# Altium schematic sheet 主控电路.SchDoc
size A4
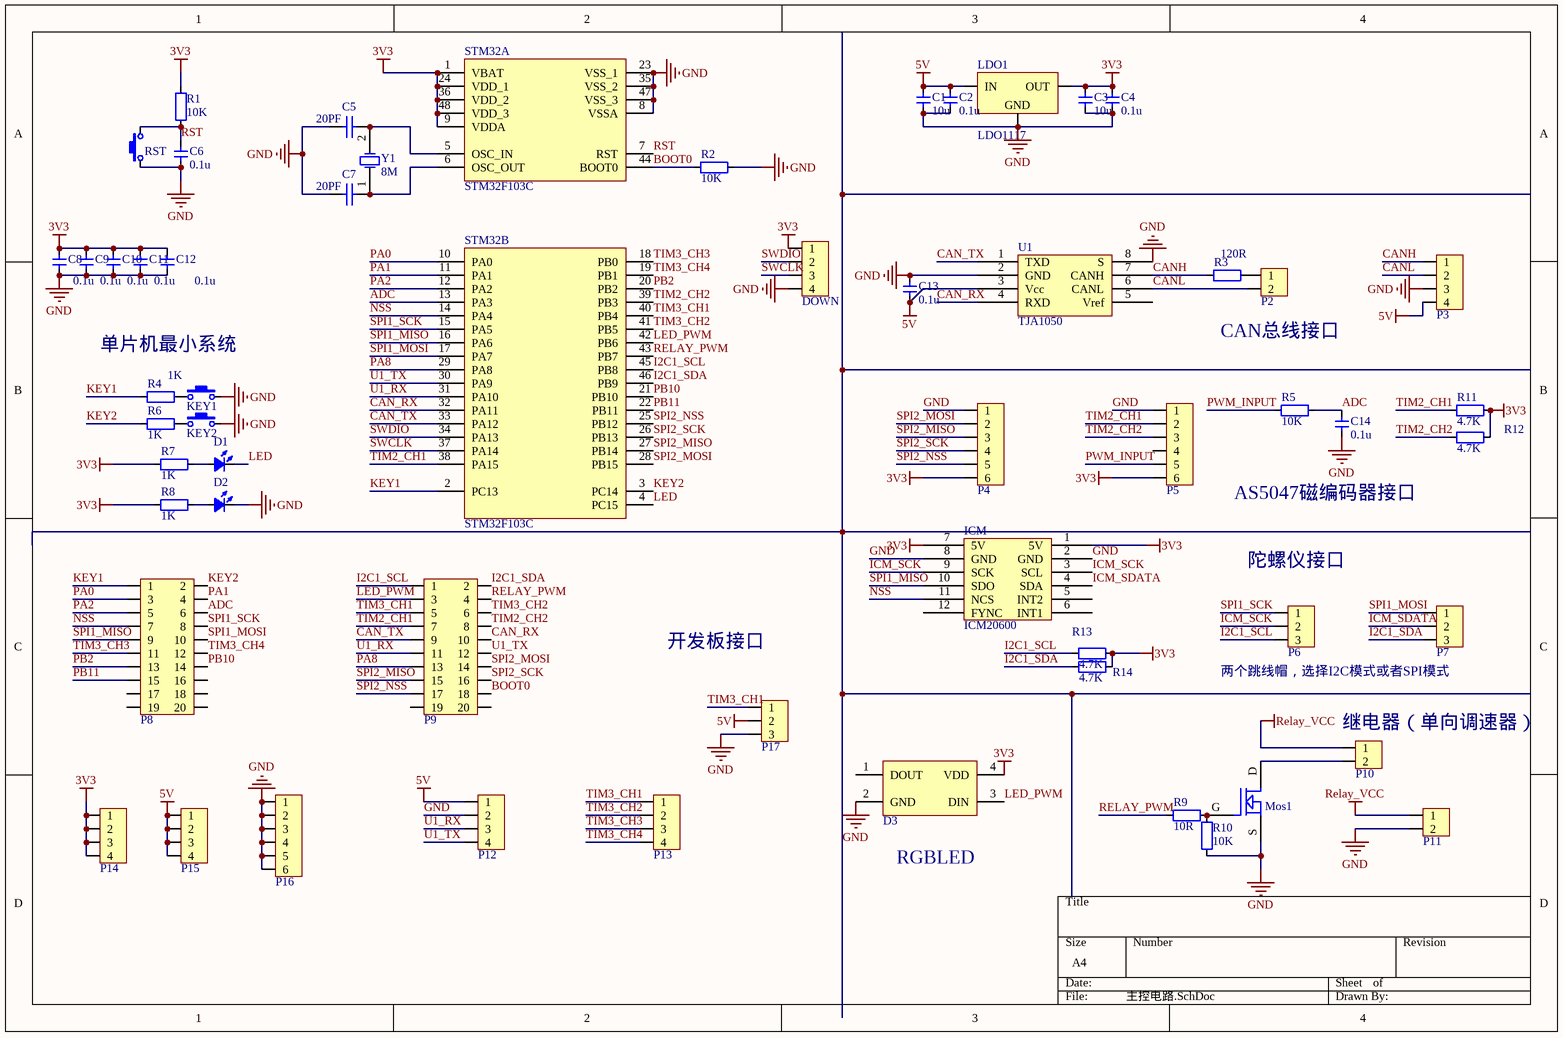
[diagram p0: 主控电路.SchDoc]

## Parts
C1  value 10u  [CAP_0805]  (hidden comment: CAP_0805)
C2  value 0.1u  [CAP_0805]  (hidden comment: CAP_0805)
C3  value 10u  [CAP_0805]  (hidden comment: CAP_0805)
C4  value 0.1u  [CAP_0805]  (hidden comment: CAP_0805)
C5  value 20PF  [CAP_0805]  (hidden comment: Cap)
C6  value 0.1u  [CAP_0805]  (hidden comment: CAP_0805)
C7  value 20PF  [CAP_0805]  (hidden comment: Cap)
C8  value 0.1u  [CAP_0805]  (hidden comment: CAP_0805)
C9  value 0.1u  [CAP_0805]  (hidden comment: CAP_0805)
C10  value 0.1u  [CAP_0805]  (hidden comment: CAP_0805)
C11  value 0.1u  [CAP_0805]  (hidden comment: CAP_0805)
C12  value 0.1u  [CAP_0805]  (hidden comment: CAP_0805)
C13  value 0.1u  [CAP_0805]  (hidden comment: CAP_0805)
C14  value 0.1u  [CAP_0805]  (hidden comment: CAP_0805)
D1  LED_0805  [LED_0805_RED]  (value not drawn)
D2  LED_0805  [LED_0805_RED]  (value not drawn)
D3  LED_3535_SK6812  [LED_3535_4P]  (value not drawn)
DOWN  HDR1x4_2.54  [HDR1x4_2.54_180]  (value not drawn)
ICM  ICM20600  [ICM20600模块]
KEY1  ButtonTACT_3x6x2.5_180  [ButtonTACT_3x6x2.5_180]  (value not drawn)
KEY2  ButtonTACT_3x6x2.5_180  [ButtonTACT_3x6x2.5_180]  (value not drawn)
LDO1  LDO1117  [SOT223-3]
Mos1  MOSFET N  [Nmos_SOT23]  (value not drawn)
P2  HDR1x2_2.54  [HDR1X2_2.54_180]  (value not drawn)
P3  HDR1x4_2.54  [HDR1x4_2.54_180]  (value not drawn)
P4  HDR1x6_2.54  [1.25mm_1X6_SMT]  (value not drawn)
P5  HDR1x6_2.54  [1.25mm_1X6_SMT]  (value not drawn)
P6  HDR1x3_2.54  [HDR1X3_2.54_180]  (value not drawn)
P7  HDR1x3_2.54  [HDR1X3_2.54_180]  (value not drawn)
P8  HDR2x10_2.54  [HDR2X10_2.54_180]  (value not drawn)
P9  HDR2x10_2.54  [HDR2X10_2.54_180]  (value not drawn)
P10  HDR1x2_2.54  [HDR1X2_2.54_180]  (value not drawn)
P11  HDR1x2_2.54  [HDR1X2_2.54_180]  (value not drawn)
P12  HDR1x4_2.54  [HDR1x4_2.54_180]  (value not drawn)
P13  HDR1x4_2.54  [HDR1x4_2.54_180]  (value not drawn)
P14  HDR1x4_2.54  [HDR1x4_2.54_180]  (value not drawn)
P15  HDR1x4_2.54  [HDR1x4_2.54_180]  (value not drawn)
P16  HDR1x6_2.54  [HDR1X6_2.54_180]  (value not drawn)
P17  HDR1x3_2.54  [HDR1X3_2.54_180]  (value not drawn)
R1  value 10K  [RES_0805]  (hidden comment: RES_0805)
R2  value 10K  [RES_0805]  (hidden comment: RES_0805)
R3  value 120R  [RES_0805]  (hidden comment: RES_0805)
R4  value 1K  [RES_0805]  (hidden comment: RES_0805)
R5  value 10K  [RES_0805]  (hidden comment: RES_0805)
R6  value 1K  [RES_0805]  (hidden comment: RES_0805)
R7  value 1K  [RES_0805]  (hidden comment: RES_0805)
R8  value 1K  [RES_0805]  (hidden comment: RES_0805)
R9  value 10R  [RES_0805]  (hidden comment: RES_0805)
R10  value 10K  [RES_0805]  (hidden comment: RES_0805)
R11  value 4.7K  [RES_0805]  (hidden comment: RES_0805)
R12  value 4.7K  [RES_0805]  (hidden comment: RES_0805)
R13  value 4.7K  [RES_0805]  (hidden comment: RES_0805)
R14  value 4.7K  [RES_0805]  (hidden comment: RES_0805)
RST  ButtonTACT_3x6x2.5_180  [ButtonTACT_3x6x2.5_180]  (value not drawn)
STM32  STM32F103C  [LQFP_P0.5_48]  (parts A,B of 2)
U1  TJA1050  [SOP_E150_8]
Y1  8M  [Osc-6032]

## Nets
3V3: C3.2 C4.2 C8.2 C9.2 C10.2 C11.2 C12.2 D3.4(VDD) DOWN.1 ICM.1(5V) ICM.7(5V) LDO1.2(OUT) P4.6 P5.6 P14.1 P14.2 P14.3 P14.4 R1.2 R7.1 R8.1 R11.1 R12.1 R13.1 R14.1 STM32.1(VBAT) STM32.9(VDDA) STM32.24(VDD_1) STM32.36(VDD_2) STM32.48(VDD_3)
5V: C1.2 C2.2 C13.1 LDO1.3(IN) P3.4 P12.1 P15.1 P15.2 P15.3 P15.4 P17.2 U1.3(Vcc)
GND: C1.1 C2.1 C3.1 C4.1 C5.1 C6.1 C7.1 C8.1 C9.1 C10.1 C11.1 C12.1 C13.2 C14.1 D2.2(K) D3.2(GND) DOWN.4 ICM.2(GND) ICM.8(GND) KEY1.2 KEY2.2 LDO1.1(GND) Mos1.S P3.3 P4.1 P5.1 P11.2 P12.2 P16.1 P16.2 P16.3 P16.4 P16.5 P16.6 P17.3 R2.2 R10.2 RST.1 STM32.8(VSSA) STM32.23(VSS_1) STM32.35(VSS_2) STM32.47(VSS_3) U1.2(GND) U1.8(S)
Relay_VCC: P10.1 P11.1
ADC: C14.2 P8.6 R5.1 STM32.13(PA3)
BOOT0: P9.18 R2.1 STM32.44(BOOT0)
CAN_RX: P9.10 STM32.32(PA11) U1.4(RXD)
CAN_TX: P9.9 STM32.33(PA12) U1.1(TXD)
CANH: P3.1 R3.1 U1.7(CANH)
CANL: P2.2 P3.2 U1.6(CANL)
I2C1_SCL: P6.3 P9.1 R13.2 STM32.45(PB8)
I2C1_SDA: P7.3 P9.2 R14.2 STM32.46(PB9)
ICM_SCK: ICM.3(SCL) ICM.9(SCK) P6.2
ICM_SDATA: ICM.4(SDA) P7.2
KEY1: P8.1 R4.1 STM32.2(PC13)
KEY2: P8.2 R6.1 STM32.3(PC14)
LED: D1.2(K) STM32.4(PC15)
LED_PWM: D3.3(DIN) P9.3 STM32.42(PB6)
NSS: ICM.11(NCS) P8.7 STM32.14(PA4)
PA0: P8.3 STM32.10(PA0)
PA1: P8.4 STM32.11(PA1)
PA2: P8.5 STM32.12(PA2)
PA8: P9.13 STM32.29(PA8)
PB2: P8.13 STM32.20(PB2)
PB10: P8.14 STM32.21(PB10)
PB11: P8.15 STM32.22(PB11)
PWM_INPUT: P5.5 R5.2
RELAY_PWM: P9.4 R9.2 STM32.43(PB7)
RST: C6.2 R1.1 RST.2 STM32.7(RST)
SPI1_MISO: ICM.10(SDO) P8.9 STM32.16(PA6)
SPI1_MOSI: P7.1 P8.10 STM32.17(PA7)
SPI1_SCK: P6.1 P8.8 STM32.15(PA5)
SPI2_MISO: P4.3 P9.15 STM32.27(PB14)
SPI2_MOSI: P4.2 P9.14 STM32.28(PB15)
SPI2_NSS: P4.5 P9.17 STM32.25(PB12)
SPI2_SCK: P4.4 P9.16 STM32.26(PB13)
SWCLK: DOWN.3 STM32.37(PA14)
SWDIO: DOWN.2 STM32.34(PA13)
TIM2_CH1: P5.2 P9.7 R11.2 STM32.38(PA15)
TIM2_CH2: P5.3 P9.8 R12.2 STM32.39(PB3)
TIM3_CH1: P9.5 P13.1 P17.1 STM32.40(PB4)
TIM3_CH2: P9.6 P13.2 STM32.41(PB5)
TIM3_CH3: P8.11 P13.3 STM32.18(PB0)
TIM3_CH4: P8.12 P13.4 STM32.19(PB1)
U1_RX: P9.11 P12.3 STM32.31(PA10)
U1_TX: P9.12 P12.4 STM32.30(PA9)
NetC5_2: C5.2 STM32.5(OSC_IN) Y1.2(OSC2)
NetC7_2: C7.2 STM32.6(OSC_OUT) Y1.1(OSC1)
NetD1_1: D1.1(A) R7.2
NetD2_1: D2.1(A) R8.2
NetKEY1_1: KEY1.1 R4.2
NetKEY2_1: KEY2.1 R6.2
NetMos1_D: Mos1.D P10.2
NetMos1_G: Mos1.G R9.1 R10.1
NetP2_1: P2.1 R3.2

Not connected (* = marked no-connect by the designer): D3 1(DOUT); ICM 5(INT2) 6(INT1) 12(FYNC); P5 4; P8 16 17 18 19 20; P9 19 20; U1 5(Vref)

## Notes on the sheet
- 单片机最小系统
- CAN总线接口
- AS5047磁编码器接口
- (near P6) 陀螺仪接口
- 开发板接口
- (near P6) 两个跳线帽，选择I2C模式或者SPI模式
- (near P10) 继电器（单向调速器）
- (near D3) RGBLED

## Library data of the parts
C1-C4 C6 C8-C14 = Cap_0603: Capacitor
C5 C7 = Cap_1: Capacitor; Published: 8-Jun-2000; LatestRevisionDate: 17-Jul-2002; LatestRevisionNote: Re-released for DXP Platform.; PackageReference: RAD-0.3; Publisher: Altium Limited
D1 D2 = LED_0805: LED
D3 = LED_3535_SK6812: LED
DOWN P3 P12-P15 = HDR1x4_2.54: Header
KEY1 KEY2 RST = ButtonTACT_3x6x2.5_180: Button
LDO1 = LDO1117: Power
Mos1 = MOSFET N: MOS SOT23
P2 P10 P11 = HDR1x2_2.54: Header
P4 P5 P16 = HDR1x6_2.54: Header
P6 P7 P17 = HDR1x3_2.54: Header
P8 P9 = HDR2x10_2.54: Header
R1-R14 = RES_0805: Resistor
STM32 = STM32F103C: MCU
Y1 = C-Osc: Crystal Oscillator; Published: 8-Jun-2000; LatestRevisionDate: 17-Jul-2002; LatestRevisionNote: Re-released for DXP Platform.; PackageReference: R38; Publisher: Altium Limited; PackageDescription: Crystal, Thru-Hole; 2 Leads; Body 3.1 x 8.2 mm (Dia.xH)